# EAGLE schematic ahrs (EAGLE 7.7.0)
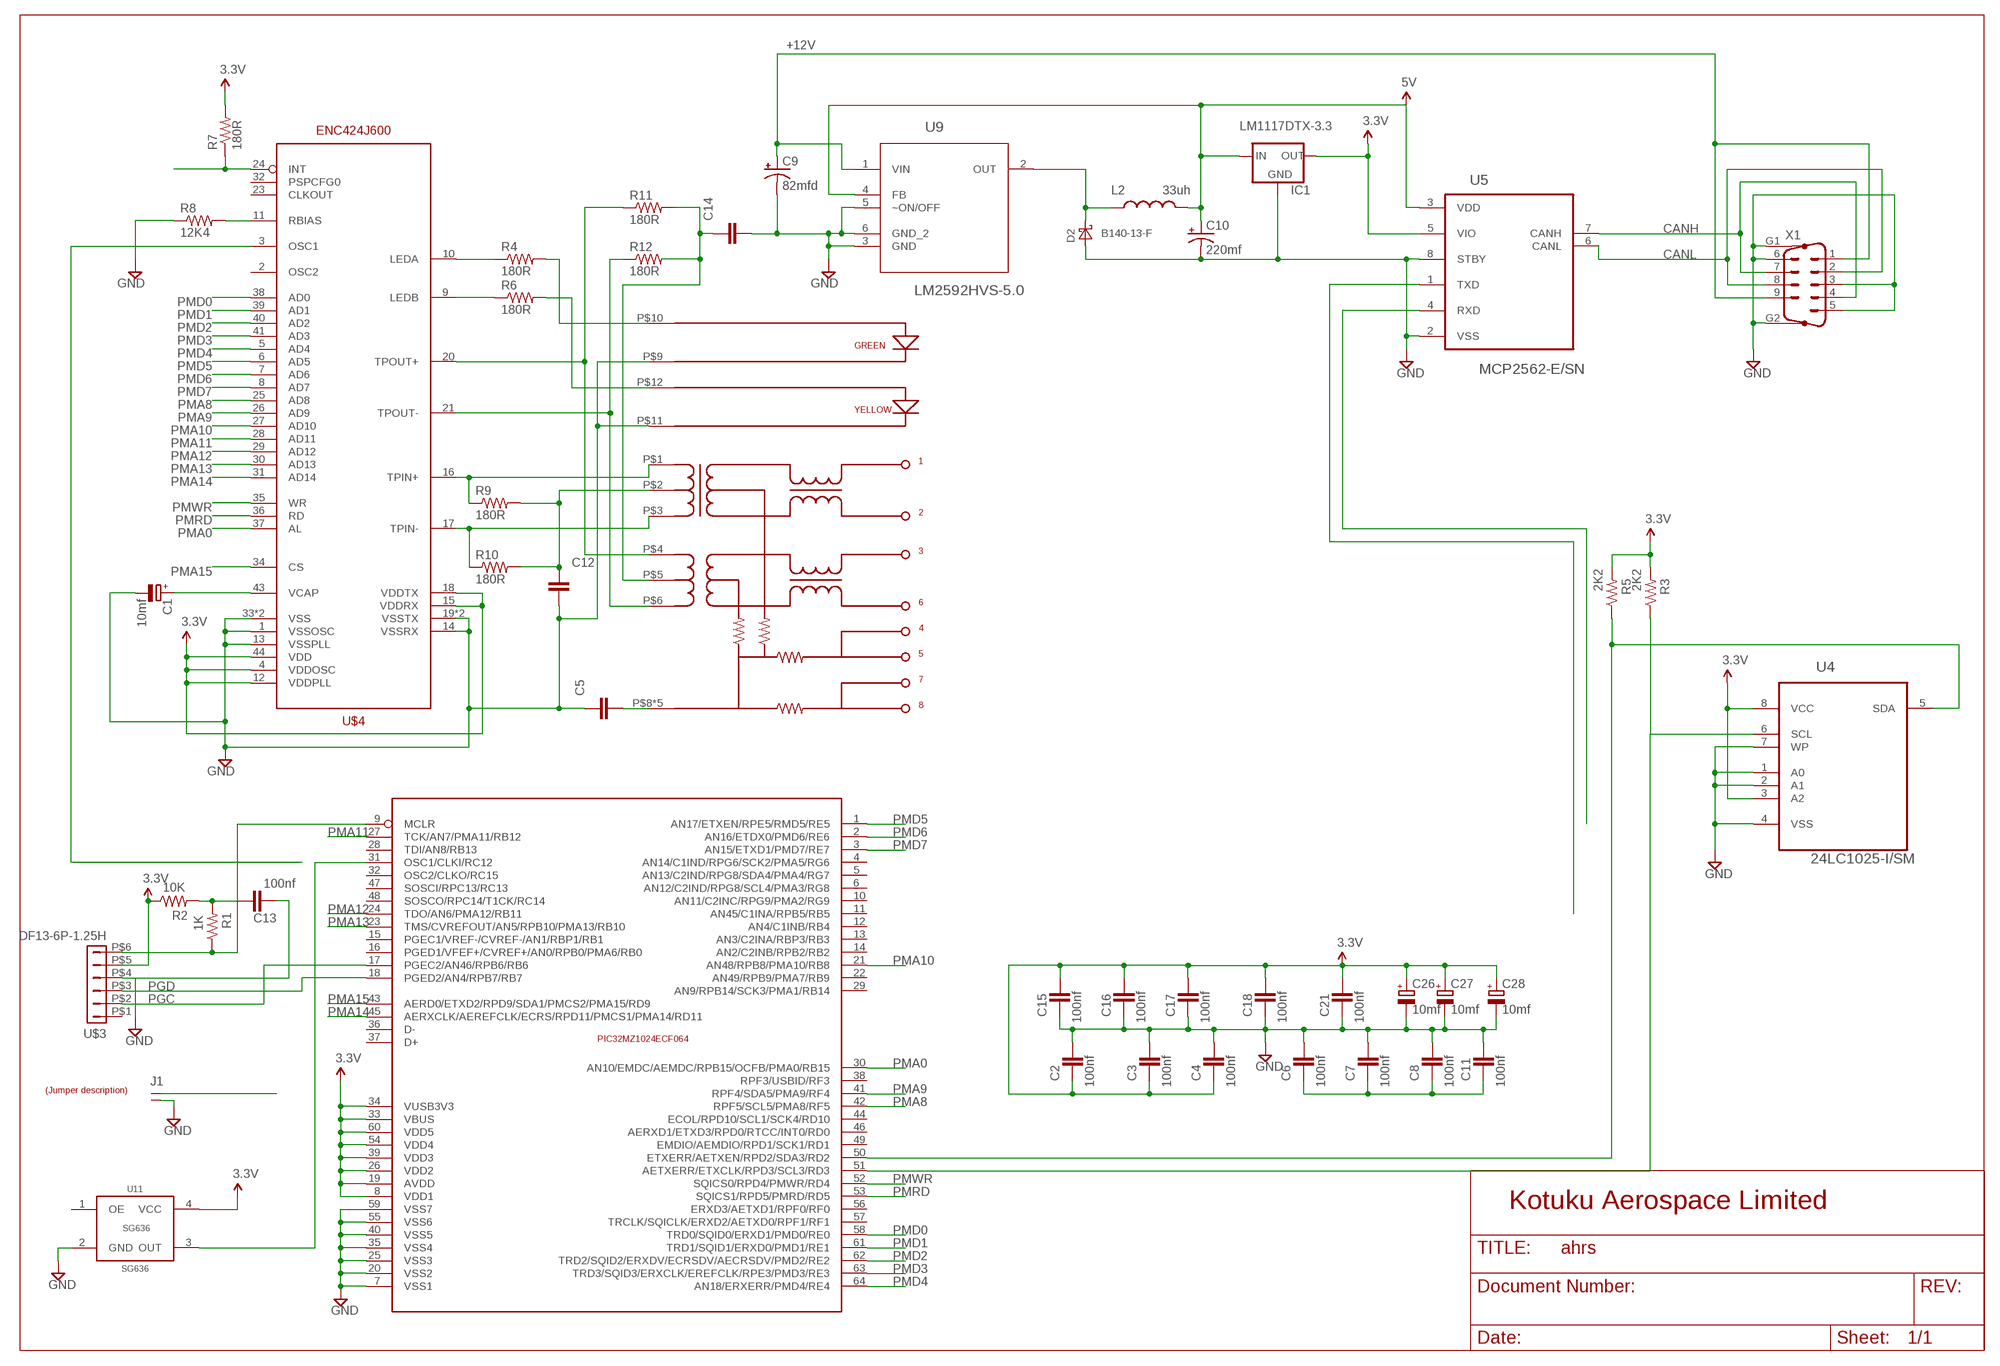
[diagram p0: schematic, sheet 1]

## Parts
C1  10mf  CAPACITOR_POL-SMC_A  [SMC_A]
C2  100nf  CAPACITOR_NPOL-0805  [C805]
C3  100nf  CAPACITOR_NPOL-0805  [C805]
C4  100nf  CAPACITOR_NPOL-0805  [C805]
C5  CAPACITOR_NPOL-1206  [C1206]
C6  100nf  CAPACITOR_NPOL-0805  [C805]
C7  100nf  CAPACITOR_NPOL-0805  [C805]
C8  100nf  CAPACITOR_NPOL-0805  [C805]
C9  82mfd  CAPACITOR_POL-SVPF-E7  [SVPF-E7]
C10  220mf  CAP_POL7343  [EIA7343]
C11  100nf  CAPACITOR_NPOL-0805  [C805]
C12  CAPACITOR_NPOL-0603  [C603]
C13  100nf  CAPACITOR_NPOL-0805  [C805]
C14  CAPACITOR_NPOL-0603  [C603]
C15  100nf  CAPACITOR_NPOL-0805  [C805]
C16  100nf  CAPACITOR_NPOL-0805  [C805]
C17  100nf  CAPACITOR_NPOL-0805  [C805]
C18  100nf  CAPACITOR_NPOL-0805  [C805]
C21  100nf  CAPACITOR_NPOL-0805  [C805]
C26  10mf  CAPACITOR_POL-SMC_A  [SMC_A]
C27  10mf  CAPACITOR_POL-SMC_A  [SMC_A]
C28  10mf  CAPACITOR_POL-SMC_A  [SMC_A]
D2  B140-13-F  DIODE-SCHOTTKY-SMA  [SMA]
IC1  LM1117DTX-3.3  [TO252]
J1  JUMPER-1X2  [JUMPER-1X2]
L2  33uh  INDUCTOR  [1812]
R1  1K  RESISTOR0603-RES  [0603-RES]
R2  10K  RESISTOR0603-RES  [0603-RES]
R3  2K2  RESISTOR0603-RES  [0603-RES]
R4  180R  RESISTOR0603-RES  [0603-RES]
R5  2K2  RESISTOR0603-RES  [0603-RES]
R6  180R  RESISTOR0603-RES  [0603-RES]
R7  180R  RESISTOR0603-RES  [0603-RES]
R8  12K4  RESISTOR0603-RES  [0603-RES]
R9  180R  RESISTOR0603-RES  [0603-RES]
R10  180R  RESISTOR0603-RES  [0603-RES]
R11  180R  RESISTOR0603-RES  [0603-RES]
R12  180R  RESISTOR0603-RES  [0603-RES]
U4  24LC1025-I/SM  [SOIC8-N_MC]
U5  MCP2562-E/SN  [SOIC-8N]
U9  LM2592HVS-5.0  [TO170P1435X457-5N]
U11  SG636  [SG636]
U$1  LABEL_JUMPER_1X2  [JUMP2_DESC]
U$2  PIC32MZ1024  [TQFP-64]
U$3  DF13-6P-1.25H  [DF13A-6P-1.25H]
U$4  ENC424J600  [TQFP44]
U$5  J1B1211CCD  [J1B1211CCD]
X1  M09HP  [M09HP]

## Nets
3.3V: C2.2 C3.2 C4.2 C15.1 C16.1 C17.1 C18.1 C21.1 C26.+ C27.+ C28.+ IC1.TAB(OUT) R2.1 R3.2 R5.2 R7.2 U4.3(A2) U4.8(VCC) U5.5(VIO) U11.4(VCC) U$2.8(VDD1) U$2.19(AVDD) U$2.26(VDD2) U$2.33(VBUS) U$2.34(VUSB3V3) U$2.39(VDD3) U$2.54(VDD4) U$2.60(VDD5) U$3.P$5 U$4.4(VDDOSC) U$4.12(VDDPLL) U$4.15(VDDRX) U$4.18(VDDTX) U$4.44(VDD)
5V: C10.A(+) IC1.2(IN) L2.2 U5.3(VDD) U9.4(FB)
!MCLR: R1.1 U$2.9(MCLR) U$3.P$6
+12V: C9.P$2(+) U9.1(VIN) X1.1 X1.9
CANH: U5.7(CANH) X1.4 X1.7
CANL: U5.6(CANL) X1.2 X1.8
GND: C1.- C2.1 C3.1 C4.1 C5.1 C6.1 C7.1 C8.1 C9.P$1(-) C10.C(-) C11.1 C12.2 C13.2 C14.2 C15.2 C16.2 C17.2 C18.2 C21.2 C26.- C27.- C28.- D2.A IC1.1(GND) J1.2 R8.1 U4.1(A0) U4.2(A1) U4.4(VSS) U4.7(WP) U5.2(VSS) U5.8(STBY) U9.3(GND) U9.5(~ON/OFF) U9.6(GND_2) U11.2(GND) U$2.7(VSS1) U$2.20(VSS2) U$2.25(VSS3) U$2.35(VSS4) U$2.40(VSS5) U$2.55(VSS6) U$2.59(VSS7) U$3.P$4 U$4.1(VSSOSC) U$4.13(VSSPLL) U$4.14(VSSRX) U$4.19(VSSTX) U$4.22(VSSTX) U$4.33(VSS) U$4.42(VSS) U$5.P$9(GREEN_K) U$5.P$11(YELLOW_K) X1.3 X1.5 X1.6 X1.G1 X1.G2
N$1: R11.1 U$4.20(TPOUT+) U$5.P$4(RX+)
N$2: R12.1 U$4.21(TPOUT-) U$5.P$6(RX-)
N$3: U5.4(RXD)
N$4: R9.1 U$4.16(TPIN+) U$5.P$1(TX+)
N$5: U$4.3(OSC1)
N$6: C13.1 R1.2 R2.2
N$7: R10.1 U$4.17(TPIN-) U$5.P$3(TX-)
N$8: U11.3(OUT) U$2.31(OSC1/CLKI/RC12)
N$9: C6.2 C7.2 C8.2 C11.2
N$10: R4.1 U$4.10(LEDA)
N$11: R4.2 U$5.P$10(GREEN_A)
N$12: D2.C L2.1 U9.2(OUT)
N$13: R6.2 U$5.P$12(YELLOW_A)
N$14: R6.1 U$4.9(LEDB)
N$15: R7.1 U$4.24(INT)
N$16: R8.2 U$4.11(RBIAS)
N$17: C5.2 U$5.P$8(GNDIN) U$5.P$13(GNDIN) U$5.P$14(GNDIN) U$5.P$15(GNDIN) U$5.P$16(GNDIN)
N$18: C1.+ U$4.43(VCAP)
N$19: C12.1 R9.2 R10.2 U$5.P$2(P2IN)
N$22: C14.1 R11.2 U$5.P$5(P5IN)
N$25: J1.1
N$26: U5.1(TXD)
PGC: U$2.17(PGEC2/AN46/RPB6/RB6) U$3.P$2
PGD: U$2.18(PGED2/AN4/RPB7/RB7) U$3.P$3
PMA0: U$2.30(AN10/EMDC/AEMDC/RPB15/OCFB/PMA0/RB15) U$4.37(AL)
PMA8: U$2.42(RPF5/SCL5/PMA8/RF5) U$4.25(AD8)
PMA9: U$2.41(RPF4/SDA5/PMA9/RF4) U$4.26(AD9)
PMA10: U$2.21(AN48/RPB8/PMA10/RB8) U$4.27(AD10)
PMA11: U$2.27(TCK/AN7/PMA11/RB12) U$4.28(AD11)
PMA12: U$2.24(TDO/AN6/PMA12/RB11) U$4.29(AD12)
PMA13: U$2.23(TMS/CVREFOUT/AN5/RPB10/PMA13/RB10) U$4.30(AD13)
PMA14: U$2.45(AERXCLK/AEREFCLK/ECRS/RPD11/PMCS1/PMA14/RD11) U$4.31(AD14)
PMA15: U$2.43(AERD0/ETXD2/RPD9/SDA1/PMCS2/PMA15/RD9) U$4.34(CS)
PMD0: U$2.58(TRD0/SQID0/ERXD1/PMD0/RE0) U$4.38(AD0)
PMD1: U$2.61(TRD1/SQID1/ERXD0/PMD1/RE1) U$4.39(AD1)
PMD2: U$2.62(TRD2/SQID2/ERXDV/ECRSDV/AECRSDV/PMD2/RE2) U$4.40(AD2)
PMD3: U$2.63(TRD3/SQID3/ERXCLK/EREFCLK/RPE3/PMD3/RE3) U$4.41(AD3)
PMD4: U$2.64(AN18/ERXERR/PMD4/RE4) U$4.5(AD4)
PMD5: U$2.1(AN17/ETXEN/RPE5/RMD5/RE5) U$4.6(AD5)
PMD6: U$2.2(AN16/ETDX0/PMD6/RE6) U$4.7(AD6)
PMD7: U$2.3(AN15/ETXD1/PMD7/RE7) U$4.8(AD7)
PMRD: U$2.53(SQICS1/RPD5/PMRD/RD5) U$4.36(RD)
PMWR: U$2.52(SQICS0/RPD4/PMWR/RD4) U$4.35(WR)
SCL: R3.1 U4.6(SCL) U$2.51(AETXERR/ETXCLK/RPD3/SCL3/RD3)
SDA: R5.1 U4.5(SDA) U$2.50(ETXERR/AETXEN/RPD2/SDA3/RD2)
Unconnected: R12.2 U11.1(OE) U$2.4(AN14/C1IND/RPG6/SCK2/PMA5/RG6) U$2.5(AN13/C2IND/RPG8/SDA4/PMA4/RG7) U$2.6(AN12/C2IND/RPG8/SCL4/PMA3/RG8) U$2.10(AN11/C2INC/RPG9/PMA2/RG9) U$2.11(AN45/C1INA/RPB5/RB5) U$2.12(AN4/C1INB/RB4) U$2.13(AN3/C2INA/RBP3/RB3) U$2.14(AN2/C2INB/RPB2/RB2) U$2.15(PGEC1/VREF-/CVREF-/AN1/RBP1/RB1) U$2.16(PGED1/VFEF+/CVREF+/AN0/RPB0/PMA6/RB0) U$2.22(AN49/RPB9/PMA7/RB9) U$2.28(TDI/AN8/RB13) U$2.29(AN9/RPB14/SCK3/PMA1/RB14) U$2.32(OSC2/CLKO/RC15) U$2.36(D-) U$2.37(D+) U$2.38(RPF3/USBID/RF3) U$2.44(ECOL/RPD10/SCL1/SCK4/RD10) U$2.46(AERXD1/ETXD3/RPD0/RTCC/INT0/RD0) U$2.47(SOSCI/RPC13/RC13) U$2.48(SOSCO/RPC14/T1CK/RC14) U$2.49(EMDIO/AEMDIO/RPD1/SCK1/RD1) U$2.56(ERXD3/AETXD1/RPF0/RF0) U$2.57(TRCLK/SQICLK/ERXD2/AETXD0/RPF1/RF1) U$3.P$1 U$4.2(OSC2) U$4.23(CLKOUT) U$4.32(PSPCFG0)

## Notes on the sheet
- Kotuku Aerospace Limited

## Library data of the parts
C1 C26-C28 = dp_devices:CAPACITOR_POL: Polarized capacitor in various packages
C2-C4 C6-C8 C11 C13 C15-C18 C21 = dp_devices:CAPACITOR_NPOL: Non-Polarized capacitor in various packages
C5 C12 C14 = kotuku:CAPACITOR_NPOL: Non-Polarized capacitor in various packages
C9 = kotuku:CAPACITOR_POL: Polarized capacitor in various packages
C10 = SparkFun:CAP_POL: Capacitor Polarized These are standard SMD and PTH capacitors. Normally 10uF, 47uF, and 100uF in electrolytic and tantalum varieties. Always verify the external diameter of the through hole cap, it varies with capacity, voltage, and manufacturer. The EIA devices should be standard.
D2 = diode2:DIODE-SCHOTTKY-: SCHOTTKY DIODE
IC1 = lm1117:LM1117DTX-*
J1 = QuantumOptics:JUMPER-1X2: Jumper, header, SIP on 0.1" grid, for option selection.
L2 = SparkFun:INDUCTOR: Inductors Basic Inductor/Choke - 0603 and 1206. Footprints are not proven and vary greatly between part numbers.
R1-R3 R5 = SparkFun-Passives:RESISTOR: Resistor Basic schematic elements and footprints for 0603, 1206, and PTH resistors.; PARTNO: ERJ-3GEYJ103V
R4 R6-R12 = kotuku:RESISTOR: Resistor Basic schematic elements and footprints for 0603, 1206, and PTH resistors.
U4 = Microchip_By_element14_Batch_1:24LC1025-I/SM: 1024K I2C CMOS Serial EEPROM
U5 = Microchip-MCP2562-E_SN:MCP2562-E/SN: High-Speed CAN Transceiver,SOIC-8
U9 = NSC_By_element14_Batch_1.1:LM2592HVS-5.0: SIMPLE SWITCHER; MPN: LM2592HVS-5.0; OC_FARNELL: -; OC_NEWARK: 41K3791; PACKAGE: TO-263-5; SUPPLIER: National Semiconductor
U11 = epson:SG636; PARTNO: SG-636PCE 10.000MHZ
U$1 = dp_devices:LABEL_JUMPER_1X2: Nice formatted two legged jumperdescription Use attributes to change the values ON = With jumper OFF = Without jumper; OFF: Normal; ON: Reset
U$2 = PIC32MZ1024ECF064:PIC32MZ1024
U$3 = con-hirose-df13:DF13-6P-1.25: DF13-6P 1.25mm Pitch Miniature Crimping Connector.
U$4 = kotuku:ENC424J600
U$5 = kotuku:J1B1211CCD
X1 = con-subd:M09HP: SUB-D; OC_FARNELL: unknown; OC_NEWARK: unknown

## Net classes
0 default: width 0.152 mm, drill 0.305 mm, clearance 0.152 mm
2 12v: width 1.27 mm, drill 0.305 mm, clearance 0.305 mm